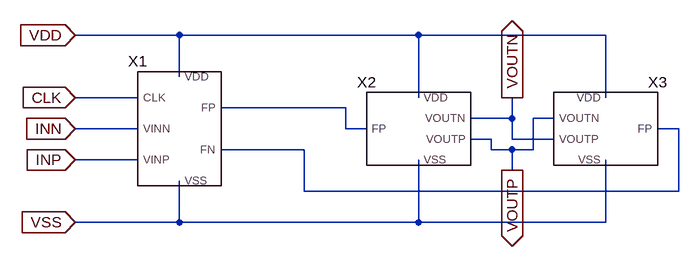
[diagram p0: schematic Draft2.asc]
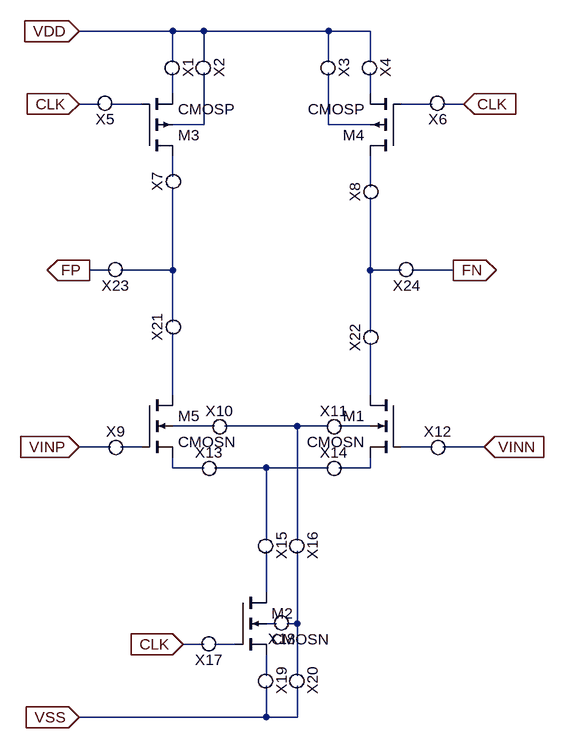
[diagram p1: sub-circuit module1.asc]
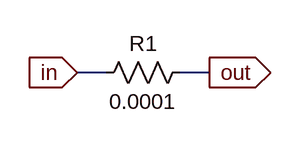
[diagram p2: sub-circuit para_register.asc]
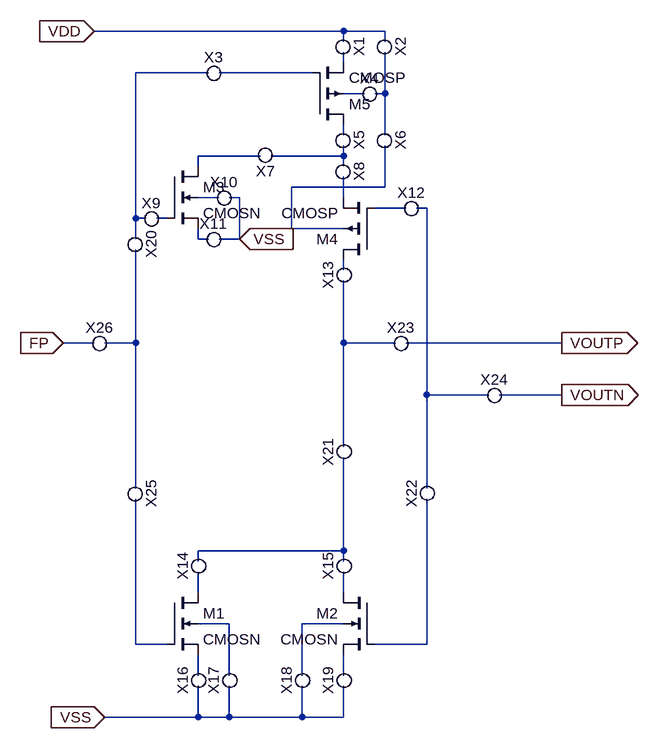
[diagram p3: sub-circuit module4.asc]
Draft2.asc, the LTspice schematic file:
Version 4
SHEET 1 932 680
WIRE 160 64 0 64
WIRE 528 64 160 64
WIRE 816 64 528 64
WIRE 160 128 160 64
WIRE 96 160 0 160
WIRE 528 160 528 64
WIRE 816 160 816 64
WIRE 416 176 224 176
WIRE 672 192 672 160
WIRE 672 192 608 192
WIRE 736 192 704 192
WIRE 96 208 0 208
WIRE 416 208 416 176
WIRE 448 208 416 208
WIRE 928 208 896 208
WIRE 640 224 608 224
WIRE 672 224 672 192
WIRE 736 224 672 224
WIRE 352 240 224 240
WIRE 640 240 640 224
WIRE 672 240 640 240
WIRE 704 240 704 192
WIRE 704 240 672 240
WIRE 96 256 0 256
WIRE 672 272 672 240
WIRE 352 304 352 240
WIRE 928 304 928 208
WIRE 928 304 352 304
WIRE 160 352 160 288
WIRE 160 352 0 352
WIRE 528 352 528 256
WIRE 528 352 160 352
WIRE 816 352 816 256
WIRE 816 352 528 352
FLAG 0 64 VDD
IOPIN 0 64 In
FLAG 0 352 VSS
IOPIN 0 352 In
FLAG 0 160 CLK
IOPIN 0 160 In
FLAG 0 208 INN
IOPIN 0 208 In
FLAG 0 256 INP
IOPIN 0 256 In
FLAG 672 272 VOUTP
IOPIN 672 272 Out
FLAG 672 160 VOUTN
IOPIN 672 160 Out
SYMBOL module1 160 208 R0
SYMATTR InstName X1
SYMBOL module4 528 208 R0
SYMATTR InstName X2
SYMBOL module4 816 208 M0
SYMATTR InstName X3

module1.asc, the sub-circuit schematic file:
Version 4
SHEET 1 1176 900
WIRE 384 -224 240 -224
WIRE 432 -224 384 -224
WIRE 624 -224 432 -224
WIRE 688 -224 624 -224
WIRE 384 -176 384 -224
WIRE 432 -176 432 -224
WIRE 624 -176 624 -224
WIRE 688 -176 688 -224
WIRE 384 -128 384 -160
WIRE 688 -128 688 -160
WIRE 272 -112 240 -112
WIRE 336 -112 288 -112
WIRE 784 -112 736 -112
WIRE 832 -112 800 -112
WIRE 432 -80 432 -160
WIRE 432 -80 384 -80
WIRE 624 -80 624 -160
WIRE 688 -80 624 -80
WIRE 384 0 384 -32
WIRE 688 16 688 -32
WIRE 288 144 256 144
WIRE 384 144 384 16
WIRE 384 144 304 144
WIRE 688 144 688 32
WIRE 736 144 688 144
WIRE 816 144 752 144
WIRE 384 224 384 144
WIRE 688 240 688 144
WIRE 384 336 384 240
WIRE 688 336 688 256
WIRE 448 384 384 384
WIRE 576 384 464 384
WIRE 624 384 576 384
WIRE 688 384 640 384
WIRE 288 416 240 416
WIRE 336 416 304 416
WIRE 784 416 736 416
WIRE 864 416 800 416
WIRE 384 448 384 432
WIRE 432 448 384 448
WIRE 528 448 448 448
WIRE 624 448 528 448
WIRE 688 448 688 432
WIRE 688 448 640 448
WIRE 528 560 528 448
WIRE 576 560 576 384
WIRE 528 640 528 576
WIRE 544 688 528 688
WIRE 576 688 576 576
WIRE 576 688 560 688
WIRE 432 720 400 720
WIRE 480 720 448 720
WIRE 528 768 528 736
WIRE 576 768 576 688
WIRE 528 832 528 784
WIRE 528 832 240 832
WIRE 576 832 576 784
WIRE 576 832 528 832
FLAG 240 -224 VDD
IOPIN 240 -224 In
FLAG 240 -112 CLK
IOPIN 240 -112 In
FLAG 240 416 VINP
IOPIN 240 416 In
FLAG 240 832 VSS
IOPIN 240 832 In
FLAG 864 416 VINN
IOPIN 864 416 In
FLAG 400 720 CLK
IOPIN 400 720 In
FLAG 832 -112 CLK
IOPIN 832 -112 In
FLAG 256 144 FP
IOPIN 256 144 Out
FLAG 816 144 FN
IOPIN 816 144 Out
SYMBOL nmos4 736 336 M0
SYMATTR InstName M1
SYMATTR Value CMOSN
SYMATTR Value2 l={L2} w={W2} m={M2}
SYMBOL nmos4 480 640 R0
SYMATTR InstName M2
SYMATTR Value CMOSN
SYMATTR Value2 l={L3} w={W3} m={M3}
SYMBOL pmos4 336 -32 M180
SYMATTR InstName M3
SYMATTR Value CMOSP
SYMATTR Value2 l={L4} w={W4} m={M4}
SYMBOL pmos4 736 -32 R180
SYMATTR InstName M4
SYMATTR Value CMOSP
SYMATTR Value2 l={L5} w={W5} m={M5}
SYMBOL nmos4 336 336 R0
SYMATTR InstName M5
SYMATTR Value CMOSN
SYMATTR Value2 l={L1} w={W1} m={M1}
SYMBOL para_register 368 -176 R90
SYMATTR InstName X1
SYMBOL para_register 416 -176 R90
SYMATTR InstName X2
SYMBOL para_register 608 -176 R90
SYMATTR InstName X3
SYMBOL para_register 672 -176 R90
SYMATTR InstName X4
SYMBOL para_register 288 -128 R180
SYMATTR InstName X5
SYMBOL para_register 800 -128 R180
SYMATTR InstName X6
SYMBOL para_register 400 16 R270
SYMATTR InstName X7
SYMBOL para_register 704 32 R270
SYMATTR InstName X8
SYMBOL para_register 288 432 R0
SYMATTR InstName X9
SYMBOL para_register 448 400 R0
SYMATTR InstName X10
SYMBOL para_register 624 400 R0
SYMATTR InstName X11
SYMBOL para_register 784 432 R0
SYMATTR InstName X12
SYMBOL para_register 432 464 R0
SYMATTR InstName X13
SYMBOL para_register 624 464 R0
SYMATTR InstName X14
SYMBOL para_register 512 560 R90
SYMATTR InstName X15
SYMBOL para_register 560 560 R90
SYMATTR InstName X16
SYMBOL para_register 448 704 R180
SYMATTR InstName X17
SYMBOL para_register 560 672 R180
SYMATTR InstName X18
SYMBOL para_register 512 768 R90
SYMATTR InstName X19
SYMBOL para_register 560 768 R90
SYMATTR InstName X20
SYMBOL para_register 400 240 R270
SYMATTR InstName X21
SYMBOL para_register 704 256 R270
SYMATTR InstName X22
SYMBOL para_register 304 128 R180
SYMATTR InstName X23
SYMBOL para_register 752 128 R180
SYMATTR InstName X24

para_register.asc, the sub-circuit schematic file:
Version 4
SHEET 1 880 680
WIRE 160 -176 128 -176
WIRE 272 -176 240 -176
FLAG 128 -176 in
IOPIN 128 -176 In
FLAG 272 -176 out
IOPIN 272 -176 Out
SYMBOL res 256 -192 R90
WINDOW 0 0 56 VBottom 2
WINDOW 3 32 56 VTop 2
SYMATTR InstName R1
SYMATTR Value 0.0001

module4.asc, the sub-circuit schematic file:
Version 4
SHEET 1 1060 772
WIRE 624 -352 240 -352
WIRE 688 -352 624 -352
WIRE 624 -336 624 -352
WIRE 688 -336 688 -352
WIRE 624 -304 624 -320
WIRE 416 -288 304 -288
WIRE 576 -288 432 -288
WIRE 656 -256 624 -256
WIRE 688 -256 688 -320
WIRE 688 -256 672 -256
WIRE 624 -192 624 -208
WIRE 688 -192 688 -256
WIRE 496 -160 400 -160
WIRE 624 -160 624 -176
WIRE 624 -160 512 -160
WIRE 400 -144 400 -160
WIRE 624 -144 624 -160
WIRE 688 -112 688 -176
WIRE 688 -112 544 -112
WIRE 432 -96 400 -96
WIRE 464 -96 448 -96
WIRE 624 -96 624 -128
WIRE 720 -80 672 -80
WIRE 752 -80 736 -80
WIRE 304 -64 304 -288
WIRE 320 -64 304 -64
WIRE 352 -64 336 -64
WIRE 544 -48 544 -112
WIRE 624 -48 544 -48
WIRE 304 -32 304 -64
WIRE 400 -32 400 -48
WIRE 416 -32 400 -32
WIRE 464 -32 464 -96
WIRE 464 -32 432 -32
WIRE 624 16 624 0
WIRE 240 128 192 128
WIRE 304 128 304 -16
WIRE 304 128 256 128
WIRE 624 128 624 32
WIRE 704 128 624 128
WIRE 960 128 720 128
WIRE 752 208 752 -80
WIRE 848 208 752 208
WIRE 960 208 864 208
WIRE 624 288 624 128
WIRE 304 352 304 128
WIRE 752 352 752 208
WIRE 624 448 624 304
WIRE 624 448 400 448
WIRE 400 464 400 448
WIRE 624 464 624 448
WIRE 400 512 400 480
WIRE 624 512 624 480
WIRE 448 560 400 560
WIRE 624 560 560 560
WIRE 304 592 304 368
WIRE 352 592 304 592
WIRE 752 592 752 368
WIRE 752 592 672 592
WIRE 400 640 400 608
WIRE 448 640 448 560
WIRE 560 640 560 560
WIRE 624 640 624 608
WIRE 400 704 400 656
WIRE 400 704 256 704
WIRE 448 704 448 656
WIRE 448 704 400 704
WIRE 560 704 560 656
WIRE 560 704 448 704
WIRE 624 704 624 656
WIRE 624 704 560 704
FLAG 464 -32 VSS
IOPIN 464 -32 In
FLAG 240 -352 VDD
IOPIN 240 -352 In
FLAG 256 704 VSS
IOPIN 256 704 In
FLAG 960 128 VOUTP
IOPIN 960 128 Out
FLAG 960 208 VOUTN
IOPIN 960 208 Out
FLAG 192 128 FP
IOPIN 192 128 In
SYMBOL nmos4 352 512 R0
SYMATTR InstName M1
SYMATTR Value CMOSN
SYMATTR Value2 l={L6} w={W6} m={M6}
SYMBOL nmos4 672 512 M0
SYMATTR InstName M2
SYMATTR Value CMOSN
SYMATTR Value2 l={L7} w={W7} m={M7}
SYMBOL nmos4 352 -144 R0
SYMATTR InstName M3
SYMATTR Value CMOSN
SYMATTR Value2 l={L8} w={W8} m={M8}
SYMBOL pmos4 672 0 R180
SYMATTR InstName M4
SYMATTR Value CMOSP
SYMATTR Value2 l={L9} w={W9} m={M9}
SYMBOL pmos4 576 -208 M180
SYMATTR InstName M5
SYMATTR Value CMOSP
SYMATTR Value2 l={L10} w={W10} m={M10}
SYMBOL para_register 608 -336 R90
SYMATTR InstName X1
SYMBOL para_register 672 -336 R90
SYMATTR InstName X2
SYMBOL para_register 416 -272 R0
SYMATTR InstName X3
SYMBOL para_register 656 -240 R0
SYMATTR InstName X4
SYMBOL para_register 608 -192 R90
SYMATTR InstName X5
SYMBOL para_register 672 -192 R90
SYMATTR InstName X6
SYMBOL para_register 512 -176 R180
SYMATTR InstName X7
SYMBOL para_register 608 -144 R90
SYMATTR InstName X8
SYMBOL para_register 320 -48 R0
SYMATTR InstName X9
SYMBOL para_register 432 -80 R0
SYMATTR InstName X10
SYMBOL para_register 416 -16 R0
SYMATTR InstName X11
SYMBOL para_register 720 -64 R0
SYMATTR InstName X12
SYMBOL para_register 640 32 R270
SYMATTR InstName X13
SYMBOL para_register 416 480 R270
SYMATTR InstName X14
SYMBOL para_register 640 480 R270
SYMATTR InstName X15
SYMBOL para_register 416 656 R270
SYMATTR InstName X16
SYMBOL para_register 464 656 R270
SYMATTR InstName X17
SYMBOL para_register 576 656 R270
SYMATTR InstName X18
SYMBOL para_register 640 656 R270
SYMATTR InstName X19
SYMBOL para_register 288 -32 R90
SYMATTR InstName X20
SYMBOL para_register 640 304 R270
SYMATTR InstName X21
SYMBOL para_register 768 368 R270
SYMATTR InstName X22
SYMBOL para_register 704 144 R0
SYMATTR InstName X23
SYMBOL para_register 848 224 R0
SYMATTR InstName X24
SYMBOL para_register 288 352 R90
SYMATTR InstName X25
SYMBOL para_register 240 144 R0
SYMATTR InstName X26

The netlist it stands for:
* Draft2.asc
XX1 CLK VDD INN INP VSS N002 N001 module1
XX2 N001 VDD VSS VOUTN VOUTP module4
XX3 N002 VDD VSS VOUTP VOUTN module4

* block symbol definitions
.subckt module1 CLK VDD VINN VINP VSS FN FP
M1 N012 N017 N020 N015 CMOSN l={L2} w={W2} m={M2}
M2 N021 N024 N025 N022 CMOSN l={L3} w={W3} m={M3}
M3 N007 N003 N001 N005 CMOSP l={L4} w={W4} m={M4}
M4 N008 N004 N002 N006 CMOSP l={L5} w={W5} m={M5}
M5 N011 N016 N018 N013 CMOSN l={L1} w={W1} m={M1}
XX1 VDD N001 para_register
XX2 VDD N005 para_register
XX3 VDD N006 para_register
XX4 VDD N002 para_register
XX5 N003 CLK para_register
XX6 CLK N004 para_register
XX7 N009 N007 para_register
XX8 N010 N008 para_register
XX9 VINP N016 para_register
XX10 N013 N014 para_register
XX11 N014 N015 para_register
XX12 N017 VINN para_register
XX13 N018 N019 para_register
XX14 N019 N020 para_register
XX15 N019 N021 para_register
XX16 N014 N023 para_register
XX17 N024 CLK para_register
XX18 N023 N022 para_register
XX19 N025 VSS para_register
XX20 N023 VSS para_register
XX21 N011 N009 para_register
XX22 N012 N010 para_register
XX23 N009 FP para_register
XX24 FN N010 para_register
.ends module1

.subckt para_register in out
R1 out in 0.0001
.ends para_register

.subckt module4 FP VDD VSS VOUTN VOUTP
M1 N020 N024 N026 N022 CMOSN l={L6} w={W6} m={M6}
M2 N021 N025 N027 N023 CMOSN l={L7} w={W7} m={M7}
M3 N007 N014 N015 N010 CMOSN l={L8} w={W8} m={M8}
M4 N016 N012 N011 N009 CMOSP l={L9} w={W9} m={M9}
M5 N006 N003 N001 N004 CMOSP l={L10} w={W10} m={M10}
XX1 VDD N001 para_register
XX2 VDD N005 para_register
XX3 N002 N003 para_register
XX4 N004 N005 para_register
XX5 N006 N008 para_register
XX6 N005 N009 para_register
XX7 N008 N007 para_register
XX8 N008 N011 para_register
XX9 N002 N014 para_register
XX10 N010 VSS para_register
XX11 N015 VSS para_register
XX12 N012 N013 para_register
XX13 N018 N016 para_register
XX14 N020 N019 para_register
XX15 N021 N019 para_register
XX16 VSS N026 para_register
XX17 VSS N022 para_register
XX18 VSS N023 para_register
XX19 VSS N027 para_register
XX20 N002 N017 para_register
XX21 N019 N018 para_register
XX22 N025 N013 para_register
XX23 N018 VOUTP para_register
XX24 N013 VOUTN para_register
XX25 N017 N024 para_register
XX26 FP N017 para_register
.ends module4

.model NMOS NMOS
.model PMOS PMOS
.lib standard.mos
.backanno
.end